# EAGLE design IntrusionNode_v2 (EAGLE 7.3.0)
DATABASE: ../../partsdb.txt
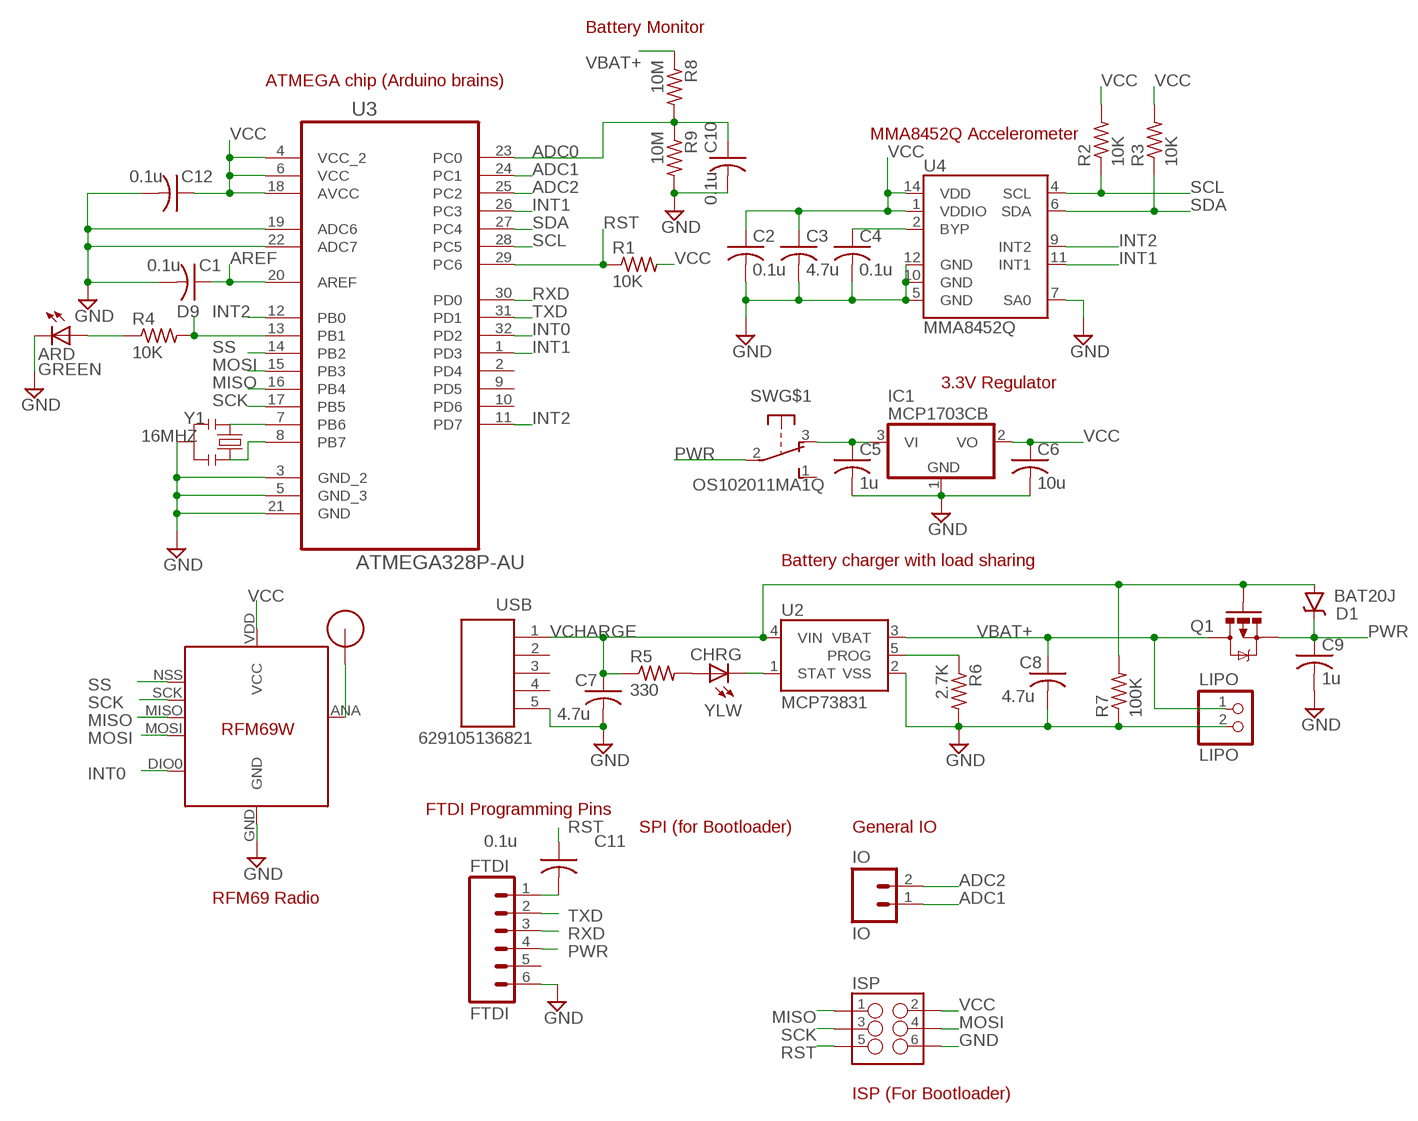
[diagram p0: schematic, sheet 1]

## Parts
ANT  RFM12B_ANTENNA  [RFM12B-ANTENNA]
ARD  GREEN  LEDCHIPLED_0805  [CHIPLED_0805]
C1  0.1u  C-USC0805  [C0805]
C2  0.1u  C-USC0805  [C0805]
C3  4.7u  C-USC0805  [C0805]
C4  0.1u  C-USC0805  [C0805]
C5  1u  C-USC0805  [C0805]
C6  10u  C-USC0805  [C0805]
C7  4.7u  C-USC0805  [C0805]
C8  4.7u  C-USC0805  [C0805]
C9  1u  C-USC0805  [C0805]
C10  0.1u  C-USC0805  [C0805]
C11  0.1u  C-USC0805  [C0805]
C12  0.1u  C-USC0805  [C0805]
CHRG  YLW  LEDCHIPLED_0805  [CHIPLED_0805]
D1  BAT20J  DIODE-SCHOTTKY-BAT20J  [SOD-323]
FTDI  FTDI  M06LOCK_LONGPADS  [1X06_LOCK_LONGPADS]
IC1  MCP1703CB  [SOT23]
IO  IO  M02LOCK_LONGPADS  [1X02_LOCK_LONGPADS]
ISP  M03X2NO_SILK  [2X3-NS]
LIPO  LIPO  JST_2PIN-SMT-RA  [JST-PH-2-SMT-RA]
Q1  MOSFET-PCHANNELSMD  [SOT23-3]
R1  10K  R-US_R0805  [R0805]
R2  10K  R-US_R0805  [R0805]
R3  10K  R-US_R0805  [R0805]
R4  10K  R-US_R0805  [R0805]
R5  330  R-US_R0805  [R0805]
R6  2.7K  R-US_R0805  [R0805]
R7  100K  R-US_R0805  [R0805]
R8  10M  R-US_R0805  [R0805]
R9  10M  R-US_R0805  [R0805]
SW  OS102011MA1Q  [OS102011MA1Q]
U1  RFM69  [RFM69W-MINPADS]
U2  MCP73831  [SOT23-5]
U3  ATMEGA328P-AU  [QFP80P900X900X120-32N]
U4  MMA8452Q  [QFN-16_0.5MM]
USB  629105136821  [629105136821]
Y1  16MHZ  SMD-RESONATOR-16MHZ-15PF-0.5%-40R(3P-3.2X1.3MM)  [X3-SMD-3.6X1.3X0.8MM]

## Nets
ADC0: C10.1 R8.2 R9.1 U3.23(PC0)
ADC1: IO.1 U3.24(PC1)
ADC2: IO.2 U3.25(PC2)
AREF: C1.1 U3.20(AREF)
D9: R4.2 U3.13(PB1)
GND: ARD.C C1.2 C2.2 C3.2 C4.2 C5.2 C6.2 C7.2 C8.2 C9.2 C10.2 C12.2 FTDI.6 IC1.1(GND) ISP.6 LIPO.2 R6.2 R7.1 R9.2 U1.GND U2.2(VSS) U3.3(GND_2) U3.5(GND_3) U3.19(ADC6) U3.21(GND) U3.22(ADC7) U4.5(GND) U4.7(SA0) U4.10(GND) U4.12(GND) USB.5 Y1.2
INT0: U1.DIO0 U3.32(PD2)
INT1: U3.1(PD3) U3.26(PC3) U4.11(INT1)
INT2: U3.11(PD7) U3.12(PB0) U4.9(INT2)
MISO: ISP.1 U1.MISO U3.16(PB4)
MOSI: ISP.4 U1.MOSI U3.15(PB3)
N$1: U3.7(PB6) Y1.1
N$2: U3.8(PB7) Y1.3
N$3: C4.1 U4.2(BYP)
N$4: ANT.P$1 U1.ANA(ANT)
N$5: ARD.A R4.1
N$6: R6.1 U2.5(PROG)
N$7: CHRG.C U2.1(STAT)
N$8: CHRG.A R5.2
N$9: C11.2 FTDI.1
N$10: C5.1 IC1.3(VI) SW.3(O)
PWR: C9.1 D1.C FTDI.4 Q1.2(S) SW.2(P)
RST: C11.1 ISP.5 R1.1 U3.29(PC6)
RXD: FTDI.3 U3.30(PD0)
SCK: ISP.3 U1.SCK U3.17(PB5)
SCL: R2.1 U3.28(PC5) U4.4(SCL)
SDA: R3.1 U3.27(PC4) U4.6(SDA)
SS: U1.NSS(SEL) U3.14(PB2)
TXD: FTDI.2 U3.31(PD1)
VBAT+: C8.1 LIPO.1 Q1.3(D) R8.1 U2.3(VBAT)
VCC: C2.1 C3.1 C6.1 C12.1 IC1.2(VO) ISP.2 R1.2 R2.2 R3.2 U1.VDD(VCC) U3.4(VCC_2) U3.6(VCC) U3.18(AVCC) U4.1(VDDIO) U4.14(VDD)
VCHARGE: C7.1 D1.A Q1.1(G) R5.1 R7.2 U2.4(VIN) USB.1
Unconnected: FTDI.5 SW.1(S) SW.MT1(MT) SW.MT2(MT) U3.2(PD4) U3.9(PD5) U3.10(PD6) USB.2 USB.3 USB.4

## Notes on the sheet
- Battery Monitor
- ATMEGA chip (Arduino brains)
- MMA8452Q Accelerometer
- 3.3V Regulator
- Battery charger with load sharing
- FTDI Programming Pins
- SPI (for Bootloader) | General IO
- RFM69 Radio
- ISP (For Bootloader)

## Library data of the parts
ANT = LowPowerLab:RFM12B_ANTENNA; PARTNO: *
ARD = led:LED: LED OSRAM: - CHIPLED LG R971, LG N971, LY N971, LG Q971, LY Q971, LO R971, LY R971 LH N974, LH R974 LS Q976, LO Q976, LY Q976 LO Q996 - Hyper CHIPLED LW Q18S LB Q993, LB Q99A, LB R99A - SideLED LS A670, LO A670, LY A670, LG A670, LP A670 LB A673, LV A673, LT A673, LW A673 LH A674 LY A675 LS A676, LA A676, LO A676, LY A676, LW A676 LS A679, LY A679, LG A679 - Hyper Micro SIDELED® LS Y876, LA Y876, LO Y876, LY Y876 LT Y87S - SmartLED LW L88C, LW L88S LB L89C, LB L89S, LG L890 LS L89K, LO L89K, LY L89K LS L896, LA L896, LO L896, LY L896 - TOPLED LS T670, LO T670, LY T670, LG T670, LP T670 LSG T670, LSP T670, LSY T670, LOP T670, LYG T670 LG T671, LOG T671, LSG T671 LB T673, LV T673, LT T673, LW T673 LH T674 LS T676, LA T676, LO T676, LY T676, LB T676, LH T676, LSB T676, LW T676 LB T67C, LV T67C, LT T67C, LS T67K, LO T67K, LY T67K, LW E67C LS E67B, LA E67B, LO E67B, LY E67B, LB E67C, LV E67C, LT E67C LW T67C LS T679, LY T679, LG T679 LS T770, LO T770, LY T770, LG T770, LP T770 LB T773, LV T773, LT T773, LW T773 LH T774 LS E675, LA E675, LY E675, LS T675 LS T776, LA T776, LO T776, LY T776, LB T776 LHGB T686 LT T68C, LB T68C - Hyper Mini TOPLED® LB M676 - Mini TOPLED Santana® LG M470 LS M47K, LO M47K, LY M47K Source: http://www.osram.convergy.de LUXEON: - LUMILED® LXK2-PW12-R00, LXK2-PW12-S00, LXK2-PW14-U00, LXK2-PW14-V00 LXK2-PM12-R00, LXK2-PM12-S00, LXK2-PM14-U00 LXK2-PE12-Q00, LXK2-PE12-R00, LXK2-PE12-S00, LXK2-PE14-T00, LXK2-PE14-U00 LXK2-PB12-K00, LXK2-PB12-L00, LXK2-PB12-M00, LXK2-PB14-N00, LXK2-PB14-P00, LXK2-PB14-Q00 LXK2-PR12-L00, LXK2-PR12-M00, LXK2-PR14-Q00, LXK2-PR14-R00 LXK2-PD12-Q00, LXK2-PD12-R00, LXK2-PD12-S00 LXK2-PH12-R00, LXK2-PH12-S00 LXK2-PL12-P00, LXK2-PL12-Q00, LXK2-PL12-R00 Source: www.luxeon.com KINGBRIGHT: KA-3528ASYC Source: www.kingbright.com; PARTNO: LG R971-KN-1
C1 C2 C4 C10-C12 = rcl:C-US: CAPACITOR, American symbol; PARTNO: CL21B104KBCNNNC
C3 C7 C8 = rcl:C-US: CAPACITOR, American symbol; PARTNO: CL21A475KPFNNNE
C5 C9 = rcl:C-US: CAPACITOR, American symbol; PARTNO: CL21B105KPFNNNE
C6 = rcl:C-US: CAPACITOR, American symbol; PARTNO: CL21B106KPQNNNE
CHRG = led:LED: LED OSRAM: - CHIPLED LG R971, LG N971, LY N971, LG Q971, LY Q971, LO R971, LY R971 LH N974, LH R974 LS Q976, LO Q976, LY Q976 LO Q996 - Hyper CHIPLED LW Q18S LB Q993, LB Q99A, LB R99A - SideLED LS A670, LO A670, LY A670, LG A670, LP A670 LB A673, LV A673, LT A673, LW A673 LH A674 LY A675 LS A676, LA A676, LO A676, LY A676, LW A676 LS A679, LY A679, LG A679 - Hyper Micro SIDELED® LS Y876, LA Y876, LO Y876, LY Y876 LT Y87S - SmartLED LW L88C, LW L88S LB L89C, LB L89S, LG L890 LS L89K, LO L89K, LY L89K LS L896, LA L896, LO L896, LY L896 - TOPLED LS T670, LO T670, LY T670, LG T670, LP T670 LSG T670, LSP T670, LSY T670, LOP T670, LYG T670 LG T671, LOG T671, LSG T671 LB T673, LV T673, LT T673, LW T673 LH T674 LS T676, LA T676, LO T676, LY T676, LB T676, LH T676, LSB T676, LW T676 LB T67C, LV T67C, LT T67C, LS T67K, LO T67K, LY T67K, LW E67C LS E67B, LA E67B, LO E67B, LY E67B, LB E67C, LV E67C, LT E67C LW T67C LS T679, LY T679, LG T679 LS T770, LO T770, LY T770, LG T770, LP T770 LB T773, LV T773, LT T773, LW T773 LH T774 LS E675, LA E675, LY E675, LS T675 LS T776, LA T776, LO T776, LY T776, LB T776 LHGB T686 LT T68C, LB T68C - Hyper Mini TOPLED® LB M676 - Mini TOPLED Santana® LG M470 LS M47K, LO M47K, LY M47K Source: http://www.osram.convergy.de LUXEON: - LUMILED® LXK2-PW12-R00, LXK2-PW12-S00, LXK2-PW14-U00, LXK2-PW14-V00 LXK2-PM12-R00, LXK2-PM12-S00, LXK2-PM14-U00 LXK2-PE12-Q00, LXK2-PE12-R00, LXK2-PE12-S00, LXK2-PE14-T00, LXK2-PE14-U00 LXK2-PB12-K00, LXK2-PB12-L00, LXK2-PB12-M00, LXK2-PB14-N00, LXK2-PB14-P00, LXK2-PB14-Q00 LXK2-PR12-L00, LXK2-PR12-M00, LXK2-PR14-Q00, LXK2-PR14-R00 LXK2-PD12-Q00, LXK2-PD12-R00, LXK2-PD12-S00 LXK2-PH12-R00, LXK2-PH12-S00 LXK2-PL12-P00, LXK2-PL12-Q00, LXK2-PL12-R00 Source: www.luxeon.com KINGBRIGHT: KA-3528ASYC Source: www.kingbright.com; PARTNO: LY R976-PS-36
D1 = SparkFun-DiscreteSemi:DIODE-SCHOTTKY: Schottky diodes in SFE's production catalog BAT20J 1A 23V 0.62Vf RB751 120mA 40V 0.37Vf PMEG4005EJ 0.5A 40V 0.42Vf MBRA140 1A 40V 0.5Vf B340A 3A 40V SMA; PARTNO: BAT20JFILM; PROD_ID: DIO-11623
FTDI = SparkFun-Connectors:M06: Header 6 Standard 6-pin 0.1" header. Use with straight break away headers (SKU : PRT-00116), right angle break away headers (PRT-00553), swiss pins (PRT-00743), machine pins (PRT-00117), and female headers (PRT-00115). Molex polarized connector foot print use with SKU : PRT-08094 with associated crimp pins and housings. NOTES ON THE VARIANTS LOCK and LOCK_LONGPADS... This footprint was designed to help hold the alignment of a through-hole component (i.e. 6-pin header) while soldering it into place. You may notice that each hole has been shifted either up or down by 0.005 of an inch from it's more standard position (which is a perfectly straight line). This slight alteration caused the pins (the squares in the middle) to touch the edges of the holes. Because they are alternating, it causes a "brace" to hold the component in place. 0.005 has proven to be the perfect amount of "off-center" position when using our standard breakaway headers. Although looks a little odd when you look at the bare footprint, once you have a header in there, the alteration is very hard to notice. Also,if you push a header all the way into place, it is covered up entirely on the bottom side. This idea of altering the position of holes to aid alignment will be further integrated into the Sparkfun Library for other footprints. It can help hold any component with 3 or more connection pins.; PARTNO: 0022284363
IC1 = linear:MCP1703: 250 mA, 16V, Low Quiescent Current LDO Regulator Source: http://ww1.microchip.com/downloads/en/DeviceDoc/22049b.pdf; PARTNO: MCP1703T-3302E/CB
IO = SparkFun-Connectors:M02: Standard 2-pin 0.1" header. Use with - straight break away headers ( PRT-00116) - right angle break away headers (PRT-00553) - swiss pins (PRT-00743) - machine pins (PRT-00117) - female headers (PRT-00115) Molex polarized connector foot print use with: PRT-08233 with associated crimp pins and housings. 2.54_SCREWTERM for use with PRT-10571. 3.5mm Screw Terminal footprints for PRT-08084 5mm Screw Terminal footprints for use with PRT-08432; PARTNO: 0022284363
ISP = SparkFun-Connectors:M03X2: 2x3 .1" header. Shrouded, with keying- CONN-10681 SMT- CONN-11415 Pogo pins- HW-11044; PARTNO: 0010897060
LIPO = adafruit:JST_2PIN: JST 2-Pin Connectors of various flavors SMT-RA (S2B-PH-SM4) 4UConnector #17311 SMT (B2B-PH-SM4) THM-RA (S2B-PH) THM (B2B-PH); PARTNO: S2B-PH-SM4-TB(LF)(SN)
Q1 = SparkFun-DiscreteSemi:MOSFET-PCHANNEL: Generic PMOSFET IRLML2244 - TRANS-11153 (SOT-23 -20V -4.3A) (1.Gate 2.Source 3.Drain) FQP27P06 - COM-10349 <http://www.sparkfun.com/products/10349> (TO-220 -60V -27A) (1.Gate 2.Source 3.Drain); PARTNO: PMV48XP,215
R1-R4 = rcl:R-US_: RESISTOR, American symbol; PARTNO: RC2012J103CS
R5 = rcl:R-US_: RESISTOR, American symbol; PARTNO: RC2012J331CS
R6 = rcl:R-US_: RESISTOR, American symbol; PARTNO: RC2012J272CS
R7 = rcl:R-US_: RESISTOR, American symbol; PARTNO: RC2012J104CS
R8 R9 = rcl:R-US_: RESISTOR, American symbol; PARTNO: RC2012F106CS
SW = adafruit:OS102011MA1Q: OS10201MA1Q through-hole right angle switch http://www.ladyada.net/library/eagle; PARTNO: OS102011MA1QN1
U1 = LowPowerLab:RFM69; PARTNO: RFM69W
U2 = SparkFun-PowerIC:MCP73831: Miniature single cell, fully integrated Li-Ion, Li-polymer charge management controller http://ww1.microchip.com/downloads/en/DeviceDoc/20001984g.pdf IC-09995; PARTNO: MCP73831T-2ATI/OT; PROD_ID: IC-09995
U3 = MTRTech:ATMEGA328P-AU: 8-bit Microcontroller with In-System Programmable Flash; MPN: ATMEGA328P-AU; OC_FARNELL: 1715486; OC_NEWARK: 14R4631; PACKAGE: TQFP-32; PARTNO: ATMEGA328P-AUR; SUPPLIER: Atmel
U4 = SparkFun-Sensors:MMA8452Q: MMA8452Q 3-Axis, 12/8-bit Digital Accelerometer Supply Voltage: 1.6-3.6V Range: +/- 2g, 4g, 8g Interface: I2C, 12-bit and 8-bit ODR: 1.56 Hz - 800 Hz Package: QFN-16 http://cache.freescale.com/files/sensors/doc/data_sheet/MMA8452Q.pdf; PARTNO: MMA8452QT; PROD_ID: IC-10769
USB = Wurth_Elektronik_Electromechanic_Input-Output_Connectors_rev15c:629105136821: WR-COM SMT Horizontal 5 Contacts Micro USB Type B,5 pins=>Code : Con_I-O_COM_MicroUSB_629105136821 <http://katalog.we-online.de/media/images/eican/Con_I-O_COM_MicroUSB_629105136821_pf2.jpg> Details see: http://katalog.we-online.de/en/em/629_105_136_821 Created 2014-07-09, Karrer Zheng 2014 (C) Würth Elektronik; PARTNO: 629105136821
Y1 = Seeed-OPL-crystal-osctllator:SMD-RESONATOR-16MHZ-15PF-0.5%-40R(3P-3.2X1.3MM): 306030002; MPN: CSTCE16M0V53-R0; PARTNO: CSTCE16M0V53-R0

## Net classes
1 power: width 0.381 mm, clearance 0.254 mm

## Board
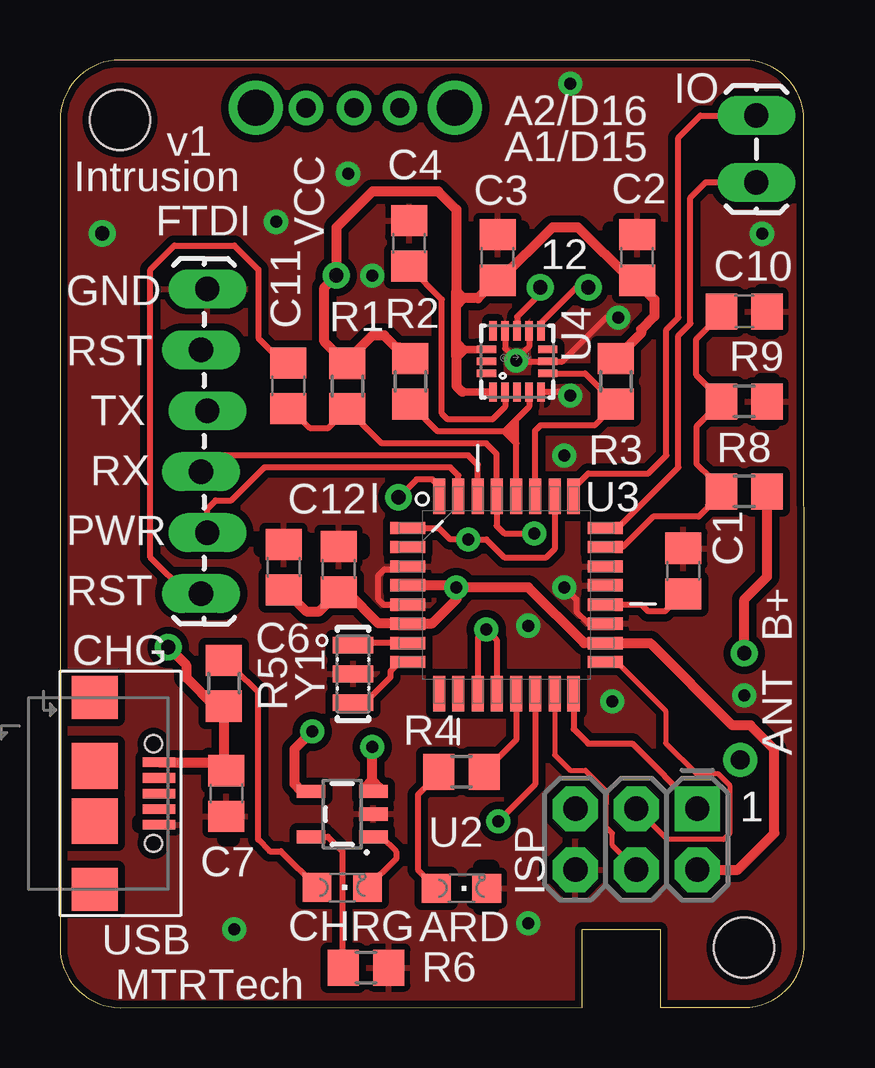
[diagram p1: board, top side]
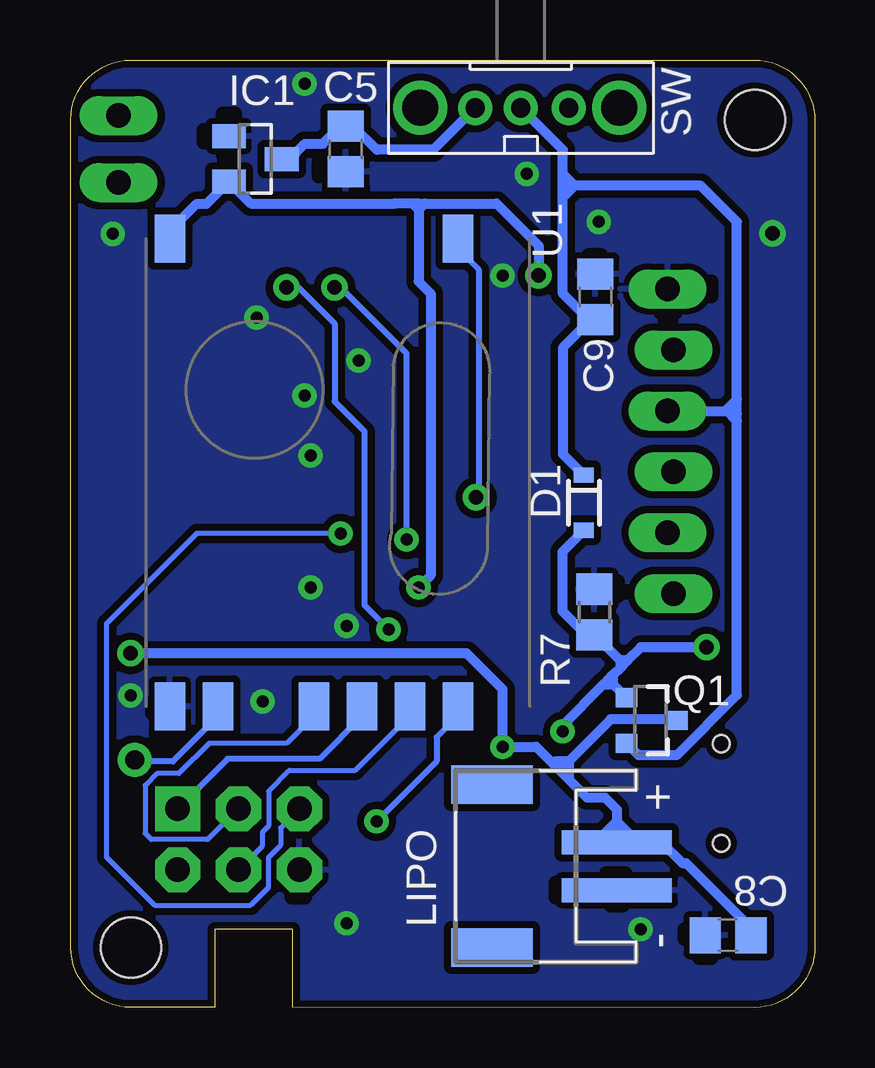
[diagram p2: board, bottom side, seen from below]

Size 31 x 39.5 mm. Coordinates in mm from the lower left corner, seen from the top.
Outline: 31,2.5 arc-89 28.5,0 25,0 25,3.25 21.75,3.25 21.75,0 2.5,0 arc-90 0,2.54 0,36.95 arc-90 2.5,39.5 28.5,39.5 arc-90 31,37.01 31,4.75 31,2.5
Outline: 31,2.5 31,2.5
Copper layers (1*16): Top 0.035mm / dielectric 1.5mm / Bottom 0.035mm
Design rules "SparkFun-2-layer": minimum track width 7mil, minimum drill 15mil, track to track 8mil, track to pad 8mil, pad to pad 8mil, via to via 8mil, smd to smd 8mil, copper to edge 8mil, drill to drill 8mil, minimum pad ring 12mil, minimum via ring 10mil, stop-mask expansion 4mil, vias tented up to drill 20mil, thermal gap 10mil
Holes 2.5 mm at 28.5,2.5 2.5,37
tRestrict: area 29.2,29.8 to 29.7,29.9; area 29.2,28.2 to 29.7,28.3; area 29.2,26.1 to 29.7,26.2; area 29.2,24.4 to 29.7,24.5; area 25,18.9 to 25.2,19.4; area 17.5,5.8 to 18,5.9; area 17.5,4.2 to 18,4.3; area 15.3,32.6 to 15.4,33.1; area 19,32 to 19.3,32.5; area 22.9,32 to 23.1,32.5; area 16.8,4.7 to 16.9,5.2; area 3.3,7.6 to 3.4,7.8; 12 more areas
bRestrict: area 27.5,12.3 to 27.6,12.8; area 20.6,34.7 to 20.7,35.2; area 24.2,37.1 to 24.7,37.3; area 25.3,36.1 to 25.5,36.6; area 8.9,31.3 to 9.4,31.4; area 8.2,17.2 to 8.4,17.8; area 8,4.3 to 8.5,4.4; area 24.3,35.6 to 24.7,35.7; area 26.6,11.4 to 27.1,11.5; area 5.3,2.9 to 5.4,3.3; area 4.3,29.7 to 4.4,30.3; area 5.8,29 to 6.4,29.1; 4 more areas

### Footprints (pad centres in the part's own frame; a part is rotated, then mirrored left to right if it is on the bottom)
RFM12B-ANTENNA = drill 0.8 pad 1.422: P$1 0,0
CHIPLED_0805 = smd 1.2 x 1.2: A 0,-1.05; C 0,1.05
C0805 = smd 1.3 x 1.5: 1 -0.95,0; 2 0.95,0
SOD-323 = smd 0.63 x 0.83: A 1.15,0; C -1.15,0
1X06_LOCK_LONGPADS = drill 1.016 long: 1 0,0; 2 2.54,-0.254; 3 5.08,0; 4 7.62,-0.254; 5 10.16,0; 6 12.7,-0.254
SOT23 = smd 1 x 1.4: 1 -0.95,-1.1; 2 0.95,-1.1; 3 0,1.1
1X02_LOCK_LONGPADS = drill 1.016 long: 1 -0.127,0; 2 2.667,0
2X3-NS = drill 1.016 pad 1.88 square: 1 -2.54,-1.27 | drill 1.016 pad 1.88 octagon: 2 -2.54,1.27; 3 0,-1.27; 4 0,1.27; 5 2.54,-1.27; 6 2.54,1.27
JST-PH-2-SMT-RA = smd 1 x 4.6: 1 1,-3.7; 2 -1,-3.7 | smd 1.6 x 3.4: NC1 -3.4,1.5; NC2 3.4,1.5
SOT23-3 = smd 0.8 x 0.9: 1 -0.95,-1; 2 0.95,-1; 3 0,1.1
R0805 = smd 1.3 x 1.5: 1 -0.95,0; 2 0.95,0
OS102011MA1Q = drill 0.8 pad 1.422: 1 -2,0; 2 0,0; 3 1.9,0 | drill 1.5 pad 2.184: MT1 -4.1,0; MT2 4.2,0
RFM69W-MINPADS = smd 2 x 1.27: ANA 8,-5; DIO0 -11.5,5; GND 8,-7; MISO 8,1; MOSI 8,3; NSS 8,5; SCK 8,-1; VDD -11.5,-7
SOT23-5 = smd 0.55 x 1.2: 1 -0.95,-1.3; 2 0,-1.3; 3 0.95,-1.3; 4 0.95,1.3; 5 -0.95,1.3
QFP80P900X900X120-32N = smd 1.473 x 0.508: 1 -4.115,2.794; 2 -4.115,2.007; 3 -4.115,1.194; 4 -4.115,0.406; 5 -4.115,-0.406; 6 -4.115,-1.194; 7 -4.115,-2.007; 8 -4.115,-2.794; 17 4.115,-2.794; 18 4.115,-2.007; 19 4.115,-1.194; 20 4.115,-0.406; 21 4.115,0.406; 22 4.115,1.194; 23 4.115,2.007; 24 4.115,2.794 | smd 0.508 x 1.473: 9 -2.794,-4.115; 10 -2.007,-4.115; 11 -1.194,-4.115; 12 -0.406,-4.115; 13 0.406,-4.115; 14 1.194,-4.115; 15 2.007,-4.115; 16 2.794,-4.115; 25 2.794,4.115; 26 2.007,4.115; 27 1.194,4.115; 28 0.406,4.115; 29 -0.406,4.115; 30 -1.194,4.115; 31 -2.007,4.115; 32 -2.794,4.115
QFN-16_0.5MM = smd 0.8 x 0.3: 1 -1.275,1; 2 -1.275,0.5; 3 -1.275,0; 4 -1.275,-0.5; 5 -1.275,-1; 9 1.275,-1; 10 1.275,-0.5; 11 1.275,0; 12 1.275,0.5; 13 1.275,1 | smd 0.3 x 0.8: 6 -0.5,-1.275; 7 0,-1.275; 8 0.5,-1.275; 14 0.5,1.275; 15 0,1.275; 16 -0.5,1.275
629105136821 = smd 0.4 x 1.35: 1 -1.3,0; 2 -0.65,0; 3 0,0; 4 0.65,0; 5 1.3,0 | smd 1.8 x 1.9: Z1 -4,-2.675; Z4 4,-2.675 | smd 1.9 x 1.9: Z2 -1.15,-2.675; Z3 1.15,-2.675 | hole 0.7: -2.075,-0.225; 2.075,-0.225
X3-SMD-3.6X1.3X0.8MM = smd 0.7 x 1.7: 1 -1.2,0; 2 0,0; 3 1.2,0

### Placement (x,y rotation side)
ANT  28.34,10.33 0 top
ARD  16.73,4.98 270 top
C1  25.97,18.2 90 top
C2  24.04,31.27 90 top
C3  18.23,31.27 90 top
C4  14.54,31.86 90 top
C5  19.54,35.8 270 bottom
C6  9.32,18.36 90 top
C7  6.93,8.93 270 top
C8  3.61,3.02 180 bottom
C9  9.14,29.63 90 bottom
C10  28.51,29.02 0 top
C11  9.51,25.92 90 top
C12  11.61,18.27 90 top
CHRG  11.76,5.01 270 top
D1  9.62,21.05 270 bottom
FTDI  5.88,17.26 90 top
IC1  23.31,35.38 270 bottom
IO  29.01,34.52 90 top
ISP  24.01,7.02 180 top
LIPO  11.95,5.9 90 bottom
Q1  6.84,11.97 270 bottom
R1  11.97,25.91 90 top
R2  14.6,26.11 90 top
R3  23.16,26.11 90 top
R4  16.73,9.83 0 top
R5  6.83,13.52 90 top
R6  12.75,1.67 0 top
R7  9.18,16.49 270 bottom
R8  28.51,21.52 180 top
R9  28.51,25.27 0 top
SW  12.25,37.5 180 bottom
U1  19.87,20.55 270 bottom
U2  11.76,8.07 90 top
U3  18.6,17.2 0 top
U4  19.04,26.94 90 top
USB  4.12,8.93 270 top
Y1  12.21,13.91 270 top

### Tracks (layer width: path | path; a pad name or v marks a point on that pad's centre or on a via)
ADC0
  Top 0.254: R8.2 27.51,21.51 | C10.1 27.11,28.56 27.11,28.46 26.51,27.86 26.51,26.36 27.56,25.31 R9.1 26.51,24.21 26.51,22.66 27.11,22.06 27.11,21.96 R8.2 | U3.23 23.45,19.2 24.71,20.46 26.61,20.46 27.01,20.86 27.01,20.96 R8.2
ADC1
  Top 0.254: U3.24 23.24,19.99 25.76,22.51 25.76,28.01 26.26,28.51 26.26,33.76 26.89,34.39 IO.1
ADC2
  Top 0.254: U3.25 21.4,21.65 22.01,22.26 24.51,22.26 25.26,23.01 25.26,28.26 25.76,28.76 25.76,36.26 26.68,37.18 IO.2
AREF
  Top 0.254: C1.1 25.95,17.26 25.2,16.51 24.51,16.51 24.24,16.79 U3.20
D9
  Top 0.254: U3.13 19.01,11.15 R4.2
GND  (via drill 0.5, 0.6)
  Top 0.254: U4.12 18.54,27.48 18.89,27.14 | 18.89,27.14 19.09,26.93 U4.7 20.93,26.93 22.76,28.76 v23.26,28.76 | U4.10 19.54,27.54 19.26,27.26 | 19.26,27.26 19.14,27.14 18.89,27.14 | 19.26,27.01 19.26,27.26 | v21.26,25.51 21.12,25.66 U4.5 | U3.5 13.49,16.79 13.26,17.01 13.26,18.01 13.51,18.26 14.36,18.26 U3.3 | v21.01,17.51 21.51,17.01 21.51,16.51 22.03,16 U3.19
  other vias: 19.51,15.92 13.01,30.52 21.01,23.02 23.01,12.77 19.01,26.97 21.26,38.52 28.51,13.02 7.26,3.27 1.76,32.27 19.51,3.52 29.25,32.25 12,34.75 9,32.75
  pour Bottom (isolate 0.305): -1.49,39.77 -1.49,-0.48 32.51,-0.48 32.51,39.77
  pour Top (isolate 0.305): -2.25,41.25 -2.24,-0.23 32.51,-0.23 32.5,41.25
INT0  (via drill 0.6)
  Top 0.254: U3.32 15.81,21.72 15.51,22.01 14.86,22.01 v14.11,21.26
  Bottom 0.254: U1.DIO0 14.87,31.62 14.01,30.76 14.01,21.36 v14.11,21.26
INT1  (via drill 0.5, 0.6)
  Top 0.254: U4.11 19.04,28.79 20.01,29.76 v20.01,30.01 | U3.1 15.79,19.99 16.26,19.51 v17.01,19.51 17.76,19.51 18.51,18.76 20.26,18.76 20.61,19.11 U3.26
  Bottom 0.254: v20.01,30.01 19.76,30.01 17.01,27.26 v17.01,19.51
INT2  (via drill 0.5, 0.6)
  Top 0.254: U4.9 20.04,28.54 21.51,30.01 v22.01,30.01 | U3.11 17.41,15.41 v17.76,15.76 18.2,15.33 U3.12
  Bottom 0.254: v22.01,30.01 21.51,30.01 20.01,28.51 20.01,25.26 18.76,24.01 18.76,16.76 v17.76,15.76
MISO
  Top 0.254: U3.16 21.4,11.6 22,11 23.84,11 ISP.1
  Bottom 0.254: U1.MISO 18.87,12.13 20.63,10.37 24.47,10.37 ISP.1
MOSI
  Top 0.203: 24.01,5.76 23.01,6.76 23.01,7.26 22.76,7.51 22.76,8.5 22.76,9.01 21.89,9.89 21.25,9.89 20.61,10.53 U3.15
  Top 0.254: ISP.4 24.01,5.76
  Bottom 0.203: 16.87,12.15 19.14,9.89 21.89,9.89 22.76,9.01 22.76,7.56 23.01,7.31 23.01,6.74 ISP.4
  Bottom 0.254: U1.MOSI 16.87,12.15
N$1
  Top 0.254: U3.7 12.3,15.19 Y1.1
N$2
  Top 0.254: U3.8 14.15,14.4 13.76,14.01 13.76,13.76 12.7,12.7 Y1.3
N$3
  Top 0.254: U4.2 18.54,25.04 18.01,24.51 16.16,24.51 15.91,24.76 15.91,29.51 14.54,30.88 C4.1 14.62,30.9
N$4
  Bottom 0.254: 24.87,12.87 U1.ANA 24.87,12.13 26.75,10.25 28.27,10.25 ANT.P$1
N$5
  Top 0.254: R4.1 15.78,9.73 14.91,8.86 14.91,5.74 ARD.A
N$6
  Top 0.254: 10.06,7.11 U2.5 11.16,7.11 11.76,6.51 11.76,1.7 R6.1
N$7
  Top 0.254: U2.1 13.39,7.11 14,6.5 14,6.19 CHRG.C
N$8
  Top 0.254: R5.2 7.2,14.1 7.3,14.1 8.25,13.15 8.25,7 8.74,6.51 9.2,6.51 CHRG.A
N$9
  Top 0.254: FTDI.1 5.27,17.25 3.76,18.76 3.76,30.76 4.76,31.76 7.26,31.76 8.26,30.76 8.26,27.91 9.01,27.16 9.21,27.16 C11.2
N$10
  Bottom 0.406: IC1.3 21.88,35.37 21.25,36 20.5,36 19.76,36.74 C5.1 19.24,36.74 18.25,35.75 15.9,35.75 SW.3
PWR
  Bottom 0.254: 9.17,28.67 C9.1
  Bottom 0.406: C9.1 8.92,28.67 | Q1.2 7.34,10.51 5.76,10.51 3.25,13.03 3.25,24.45 | C9.1 9.23,28.76 9.61,28.76 9.61,28.86 10.5,29.75 10.5,33.75 | 9.5,28.67 C9.1 | SW.2 10.5,35.75 10.5,34.75 | C9.1 9.33,28.67 10.5,27.5 10.5,23.07 D1.C | 10.5,33.75 10.5,34.25 | 10.5,34.25 10.5,34.75 | 3.25,24.45 3.25,24.75 | 3.25,24.75 3.25,25.35 | 3.25,25.35 3.25,32.75 4.75,34.25 10,34.25 | 10,34.25 10.5,34.25 | FTDI.4 3.37,24.87 3.25,24.75 | 10,34.25 10.5,34.75 | 10,34.25 10.5,33.75 | 3.25,25.35 3.7,24.9 3.25,24.45
RST  (via drill 0.5)
  Top 0.254: C11.1 9.61,24.96 10.41,24.16 11.18,24.16 R1.1 13.41,23.51 17.76,23.51 18.2,23.08 U3.29 | U3.29 18.26,21.24 | U3.29 18.2,20.08 18.51,19.76 v19.76,19.76
  Bottom 0.203: v19.76,19.76 25.76,19.76 29.51,16.01 29.51,6.26 29.01,5.76 27.51,4.26 23.51,4.26 22.76,5.01 22.76,6.26 22.26,6.76 22.26,7.49 ISP.5
RXD
  Top 0.254: U3.30 17.41,22.62 17.01,23.01 6.56,23.01 FTDI.3
SCK
  Top 0.203: 23.2,14.4 25.24,12.36 25.24,11.01 26.5,9.75 27.41,9.75 27.9,9.26 27.9,7.25 27.65,7 25.3,7 ISP.3
  Top 0.254: U3.17 23.2,14.4
  Bottom 0.203: 20.87,12.15 22.01,11.01 25.24,11.01 26.5,9.75 27.41,9.75 27.9,9.26 27.9,7.25 27.65,7 25.3,7 ISP.3
  Bottom 0.254: U1.SCK 20.87,12.15 | ISP.3
SCL
  Top 0.254: U4.4 19.54,25.04 19.01,24.51 | 19.01,24.51 18.76,24.26 | 18.76,24.26 18.51,24.01 | 18.51,24.01 15.74,24.01 R2.1 | U3.28 19.01,23.52 18.76,23.76 | 18.76,23.76 18.51,24.01 | 18.76,23.76 18.76,24.26 | 19.01,23.51 19.01,24.51
SDA
  Top 0.254: U3.27 19.8,24.05 20.01,24.26 22.27,24.26 R3.1 21.88,26.43 U4.6
SS  (via drill 0.5)
  Top 0.254: U3.14 19.8,9.3 v18.26,7.76
  Bottom 0.254: U1.NSS 14.87,12.15 15.76,11.26 15.76,10.26 v18.26,7.76
TXD
  Top 0.254: U3.31 16.6,22.18 16.26,22.51 8.51,22.51 7.14,21.14 6.49,21.14 6.14,20.79 FTDI.2
VBAT+  (via drill 0.5, 0.6)
  Top 0.254: 13.01,9.06 U2.3
  Top 0.406: 13.01,9.46 13.01,9.06 | 13.01,9.46 12.71,9.16 | 13.01,9.46 13.31,9.16 | 29.51,21.46 R8.1 29.46,17.96 28.51,17.01 v28.51,14.76 | 13.01,9.46 v13.01,10.86
  Bottom 0.254: Q1.3 5.79,12.01 | 10.26,10.26 10.64,9.89
  Bottom 0.406: 10.26,9.51 10.64,9.89 11.01,10.26 | 5.79,12.01 8.51,12.01 10.26,10.26 | 10.26,10.26 10.26,9.76 | 10.26,9.76 10.26,9.51 | 10.26,10.26 10.76,10.26 | 11.01,10.26 10.76,10.26 | 10.76,10.26 10.26,9.76 | v28.51,14.76 14.51,14.76 13.01,13.26 v13.01,10.86 11.61,10.86 11.01,10.26 | C8.1 2.91,3.26 2.91,3.56 5.36,6.01 5.51,6.01 6.39,6.89 LIPO.1 8.25,7.75 | 10.26,9.51 9.5,8.75 8.75,8.75 8.25,8.25 8.25,7.75 | 8.25,7.75 9,7 | 8.25,7.75 7.5,7
VCC  (via drill 0.5, 0.6)
  Top 0.254: 23.04,27.05 R3.2 23.3,27.05 | 23.96,30.31 C2.1 | U3.4 14.57,17.51 | 18.2,30.26 18.23,30.23 C3.1 18.31,30.31 | 16.51,17.26 v16.51,17.51 16.43,17.6 16.51,17.69 | 16.81,29.56 16.56,29.56 | 11.97,26.97 R1.2 | 14.47,16.01 U3.6
  Top 0.305: 16.51,27.43 U4.14 | 16.76,25.66 U4.1
  Top 0.406: 16.51,27.11 16.51,27.43 16.51,27.71 | 16.51,27.71 16.81,27.41 16.51,27.11 | 14.47,27.05 R2.2 14.14,27.51 14.01,27.51 13.51,28.01 13.01,28.01 11.97,26.97 | 16.51,27.71 16.51,29.26 | 16.51,29.26 16.51,29.51 | 16.51,29.51 16.51,29.86 | 18.31,30.31 20.51,32.51 21.59,32.51 23.79,30.31 23.96,30.31 | 16.43,17.6 U3.4 | 18.2,30.26 18.11,30.26 17.41,29.56 16.81,29.56 | 16.56,29.56 16.51,29.51 | 16.81,29.56 16.51,29.86 | 16.81,29.56 16.51,29.26 | R1.2 11.56,27.26 11.51,27.26 11.01,27.76 11.01,30.01 v11.51,30.51 11.51,32.51 13.01,34.01 15.76,34.01 16.51,33.26 16.51,29.86 | 14.47,16.01 13.26,16.01 11.96,17.31 C12.1 10.81,16.51 10.26,16.51 9.37,17.4 C6.1 | U3.6 14.5,16.01 15.51,16.01 16.51,17.01 v16.51,17.51 19.51,17.51 21.84,15.19 U3.18 24.59,15.19 28.01,11.76 28.76,11.76 29.76,10.76 29.76,7.26 28.24,5.74 ISP.2 | 16.51,27.11 16.51,25.91 16.76,25.66 | C2.1 24.04,30.23 24.76,29.51 24.76,28.81 24.21,28.26 24.21,28.1 R3.2
  Bottom 0.254: 16.51,33.51 16.51,33.26 | 17.51,33.52 17.51,33.51
  Bottom 0.406: 16.76,33.51 16.51,33.51 16.26,33.51 | 16.76,33.51 17,33.51 17.51,33.51 | 16.26,33.51 16.51,33.26 | 16.51,33.26 16.76,33.51 | 16.26,33.51 13.26,33.51 11.51,31.76 v11.51,30.51 | 16.51,33.26 16.51,30.26 16.01,29.76 16.01,18.01 v16.51,17.51 | 17.53,33.5 17.51,33.51 | U1.VDD 26.87,32.38 25.75,33.5 25.34,33.5 IC1.2 23.5,33.51 17.51,33.51
VCHARGE  (via drill 0.5, 0.6)
  Top 0.406: v10.51,11.51 9.76,10.76 9.76,9.31 10.06,9.01 U2.4 | USB.1 6.58,10.22 C7.1 6.83,9.97 R5.1 6.44,12.56 5.25,13.75 5.25,14.28 v4.51,15.01
  Bottom 0.254: 8.57,13.64 8.64,13.64 | 9.76,15.76 9.41,15.76 | 8.11,14.46 7.96,14.31
  Bottom 0.406: v4.51,15.01 7.26,15.01 7.81,14.46 | 7.81,14.46 7.96,14.31 8.11,14.16 | 8.41,13.86 8.64,13.64 8.81,13.46 | 8.57,13.64 Q1.1 | 8.81,13.46 8.41,13.46 8.41,13.86 | 9.76,15.76 10.51,16.51 10.51,19 D1.A | 9.41,15.76 R7.2 8.11,14.46 | v10.51,11.51 10.51,11.76 8.81,13.46 | 7.81,14.46 8.11,14.46 | 8.11,14.46 8.11,14.16 | 8.11,14.16 8.41,13.86

### Text on the board
tPlace: A2/D16 | v1 | A1/D15 | Intrusion | VCC | 1 | 2 | GND | RST | TX | RX | I | PWR | RST | B+ | CHG | ANT | 1 | MTRTech